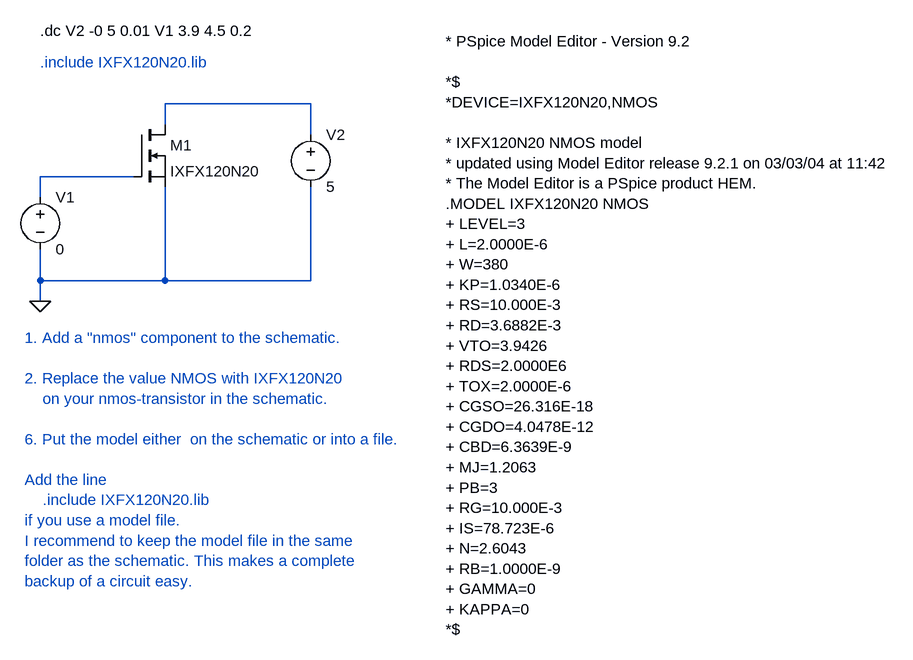
[diagram p0: schematic IXFX120N20_test.asc]
IXFX120N20_test.asc, the LTspice schematic file:
Version 4
SHEET 1 1512 988
WIRE -448 432 -448 400
WIRE -448 272 -448 240
WIRE -448 240 -304 240
WIRE -256 128 -256 160
WIRE -256 256 -256 400
WIRE -256 400 -448 400
WIRE -448 400 -448 352
WIRE -32 176 -32 128
WIRE -32 128 -256 128
WIRE -256 400 -32 400
WIRE -32 400 -32 256
FLAG -448 432 0
SYMBOL voltage -448 256 R0
SYMATTR InstName V1
SYMATTR Value 0
SYMBOL voltage -32 160 R0
SYMATTR InstName V2
SYMATTR Value 5
SYMBOL nmos -304 160 R0
SYMATTR InstName M1
SYMATTR Value IXFX120N20
TEXT -448 16 Left 0 !.dc V2 -0 5 0.01 V1 3.9 4.5 0.2
TEXT -472 488 Left 0 ;1. Add a "nmos" component to the schematic.\n \n2. Replace the value NMOS with IXFX120N20 \n    on your nmos-transistor in the schematic.\n \n6. Put the model either  on the schematic or into a file.\n \nAdd the line  \n    .include IXFX120N20.lib\nif you use a model file. \nI recommend to keep the model file in the same \nfolder as the schematic. This makes a complete\nbackup of a circuit easy.
TEXT -448 64 Left 0 ;.include IXFX120N20.lib
TEXT 176 32 Left 0 !* PSpice Model Editor - Version 9.2\n \n*$\n*DEVICE=IXFX120N20,NMOS\n \n* IXFX120N20 NMOS model\n* updated using Model Editor release 9.2.1 on 03/03/04 at 11:42\n* The Model Editor is a PSpice product HEM.\n.MODEL IXFX120N20 NMOS\n+ LEVEL=3\n+ L=2.0000E-6\n+ W=380\n+ KP=1.0340E-6\n+ RS=10.000E-3\n+ RD=3.6882E-3\n+ VTO=3.9426\n+ RDS=2.0000E6\n+ TOX=2.0000E-6\n+ CGSO=26.316E-18\n+ CGDO=4.0478E-12\n+ CBD=6.3639E-9\n+ MJ=1.2063\n+ PB=3\n+ RG=10.000E-3\n+ IS=78.723E-6\n+ N=2.6043\n+ RB=1.0000E-9\n+ GAMMA=0\n+ KAPPA=0\n*$

The netlist it stands for:
* IXFX120N20_test.asc
V1 N001 0 0
V2 N002 0 5
M1 N002 N001 0 0 IXFX120N20
.model NMOS NMOS
.model PMOS PMOS
.lib standard.mos
.dc V2 -0 5 0.01 V1 3.9 4.5 0.2
* 1. Add a "nmos" component to the schematic.
* 2. Replace the value NMOS with IXFX120N20
*     on your nmos-transistor in the schematic.
* 6. Put the model either  on the schematic or into a file.
* Add the line
*     .include IXFX120N20.lib
* if you use a model file.
* I recommend to keep the model file in the same
* folder as the schematic. This makes a complete
* backup of a circuit easy.
* .include IXFX120N20.lib
* PSpice Model Editor - Version 9.2
*$
*DEVICE=IXFX120N20,NMOS
* IXFX120N20 NMOS model
* updated using Model Editor release 9.2.1 on 03/03/04 at 11:42
* The Model Editor is a PSpice product HEM.
.MODEL IXFX120N20 NMOS
+ LEVEL=3
+ L=2.0000E-6
+ W=380
+ KP=1.0340E-6
+ RS=10.000E-3
+ RD=3.6882E-3
+ VTO=3.9426
+ RDS=2.0000E6
+ TOX=2.0000E-6
+ CGSO=26.316E-18
+ CGDO=4.0478E-12
+ CBD=6.3639E-9
+ MJ=1.2063
+ PB=3
+ RG=10.000E-3
+ IS=78.723E-6
+ N=2.6043
+ RB=1.0000E-9
+ GAMMA=0
+ KAPPA=0
*$
.backanno
.end